# Altium project 12V_SEPIC.PrjPCB
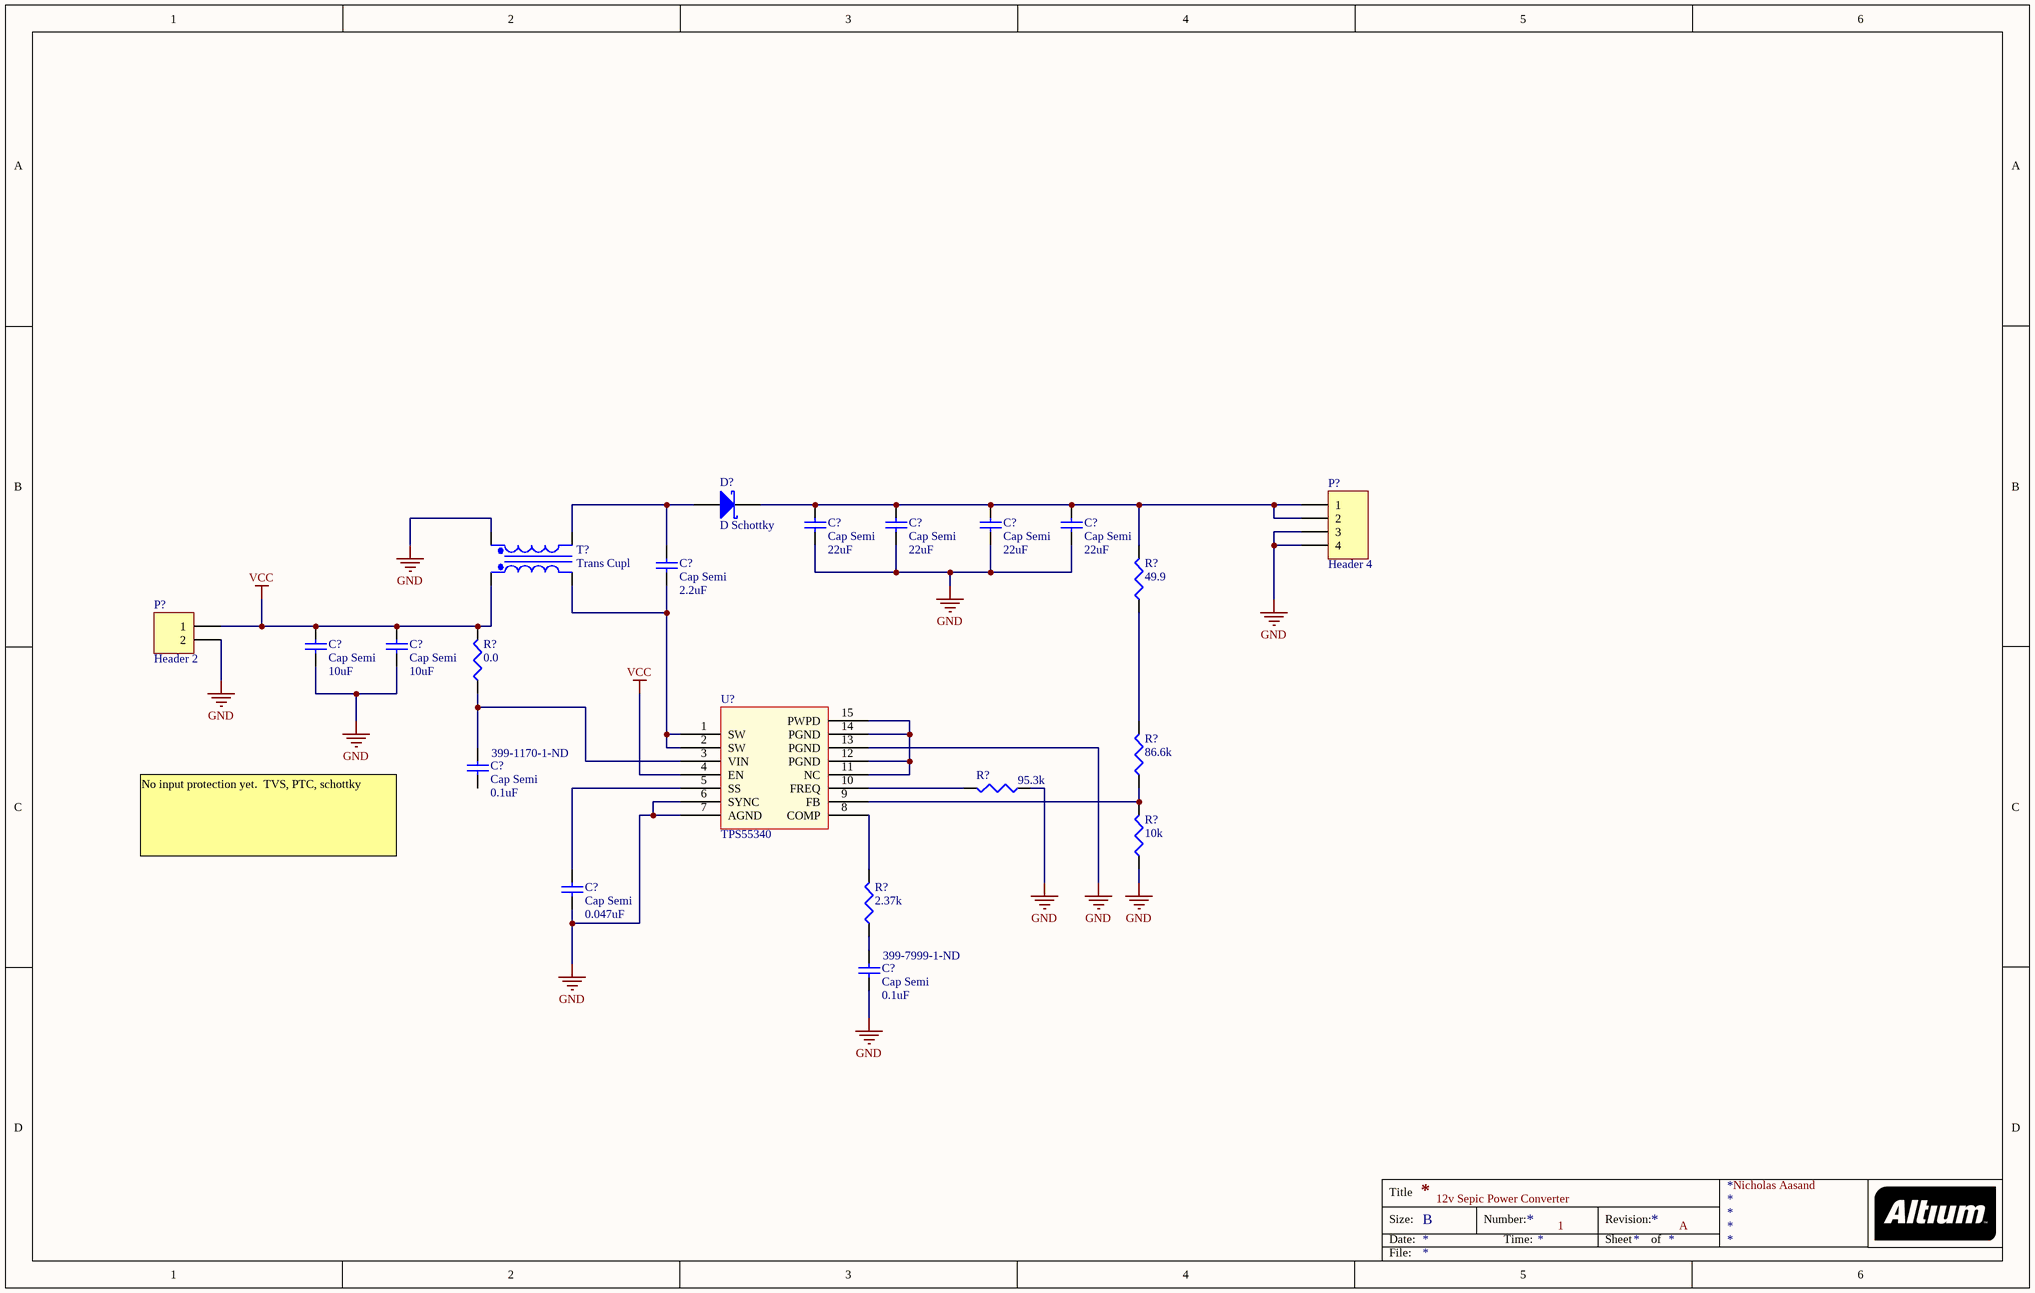
[diagram p0: 12v_SEPIC.SchDoc]
1 sheet, 21 parts. Net scope: global (net labels, ports and power ports of the same name join across sheets).

## Sheet 12v_SEPIC.SchDoc
size B

### Parts
(Parts that share a designator on the sheet are numbered #1, #2 ... from top to bottom, then left to right.)
C?#1  Cap Semi  value 22uF  [C1206]
C?#2  Cap Semi  value 22uF  [C1206]
C?#3  Cap Semi  value 22uF  [C1206]
C?#4  Cap Semi  value 22uF  [C1206]
C?#5  Cap Semi  value 2.2uF  [C1206]
C?#6  Cap Semi  value 10uF  [C1210]
C?#7  Cap Semi  value 10uF  [C1210]
C?#8  Cap Semi  value 0.1uF  Digikey: 399-1170-1-ND  [C0805]
C?#9  Cap Semi  value 0.047uF  [C0805]
C?#10  Cap Semi  value 0.1uF  Digikey: 399-7999-1-ND  [C0805]
D?  D Schottky  [DSO-C2/X1.8]
P?#1  Header 4  [HDR1X4]
P?#2  Header 2  [HDR1X2]
R?#1  value 49.9  [RESC2012L]  (hidden comment: 0805)
R?#2  value 0.0  [J1-0603]  (hidden comment: 0603)
R?#3  value 86.6k  [RESC2012L]  (hidden comment: 0805)
R?#4  value 95.3k  [J1-0603]  (hidden comment: 0603)
R?#5  value 10k  [RESC2012L]  (hidden comment: 0805)
R?#6  value 2.37k  [J1-0603]  (hidden comment: 0603)
T?  Trans Cupl  [TRF_4]
U?  TPS55340

### Nets
GND: C?#1.1 C?#2.1 C?#3.1 C?#4.1 C?#6.2 C?#7.2 C?#9.2 C?#10.2 P?#1.3 P?#1.4 P?#2.2 R?#4.1 R?#5.1 T?.3(Sec+) U?.6(SYNC) U?.7(AGND) U?.13(PGND)
VCC: C?#6.1 C?#7.1 P?#2.1 R?#2.2 T?.1(Pri+) U?.4(EN)
NetC?#1_2: C?#1.2 C?#2.2 C?#3.2 C?#4.2 D?.2(K) P?#1.1 P?#1.2 R?#1.2
NetC?#5_1: C?#5.1 D?.1(A) T?.4(Sec-)
NetC?#5_2: C?#5.2 T?.2(Pri-) U?.1(SW) U?.2(SW)
NetC?#8_1: C?#8.1 R?#2.1 U?.3(VIN)
NetC?#9_1: C?#9.1 U?.5(SS)
NetC?#10_1: C?#10.1 R?#6.1
NetR?#1_1: R?#1.1 R?#3.2
NetR?#3_1: R?#3.1 R?#5.2 U?.9(FB)
NetR?#4_2: R?#4.2 U?.10(FREQ)
NetR?#6_2: R?#6.2 U?.8(COMP)
NetU?_11: U?.11(NC) U?.12(PGND) U?.14(PGND) U?.15(PWPD)

Not connected (* = marked no-connect by the designer): C?#8 2

### Notes on the sheet
- No input protection yet.  TVS, PTC, schottky
- 12v Sepic Power Converter
- 1
- A
- Nicholas Aasand
- Title
- Size:
- Date:
- B
- Number:
- Time:
- Revision:
- Sheet
- of
- File:

### Library data of the parts
C?#1-C?#10 = Cap Semi: Capacitor (Semiconductor SIM Model); Published: 8-Jun-2000; LatestRevisionDate: 29-May-2009; LatestRevisionNote: IPC-7351 Footprint Added.; Publisher: Altium Limited; PackageDescription: Chip Capacitor
  C?#1-C?#4: PackageReference: C1206; Digikey: 1276-3047-1-ND
  C?#5: PackageReference: C1206; Digikey: 1276-1291-1-ND
  C?#6 C?#7: PackageReference: C1206; Digikey: 1276-3389-1-ND
  C?#8 C?#10: PackageReference: C0805
  C?#9: PackageReference: C0805; Digikey: 478-6221-1-ND
D? = D Schottky: Schottky Diode; Published: 8-Jun-2000; LatestRevisionDate: 17-Jul-2002; LatestRevisionNote: Re-released for DXP Platform.; PackageReference: SMA; Publisher: Altium Limited; PackageDescription: DO-214-AA/SMB; 2 C-Bend Leads; Body 5.3 x 3.6 mm, inc. leads (LxW); Code_JEDEC: DO-214-AA; Digikey: 641-1258-1-ND
P?#1 = Header 4: Header, 4-Pin; LatestRevisionDate: 17-Jul-2002; LatestRevisionNote: Re-released for DXP Platform.; Publisher: Altium Limited
P?#2 = Header 2: Header, 2-Pin; LatestRevisionDate: 17-Jul-2002; LatestRevisionNote: Re-released for DXP Platform.; Publisher: Altium Limited
R?#1-R?#6 = Res3: Resistor
  R?#1: Digikey: RMCF0805FT49R9CT-ND
  R?#2: Digikey: RMCF0603ZT0R00CT-ND
  R?#3: Digikey: RMCF0805FT86K6CT-ND
  R?#4: Digikey: RMCF0603FT95K3CT-ND
  R?#5: Digikey: RMCF0805FT10K0CT-ND
  R?#6: Digikey: RMCF0603FT2K37CT-ND
T? = Trans Cupl: Transformer (Coupled Inductor Model); Coilcraft: MSD1260-123MLB; Published: 8-Jun-2000; LatestRevisionDate: 17-Jul-2002; LatestRevisionNote: Re-released for DXP Platform.; PackageReference: TRF_4; Publisher: Altium Limited; PackageDescription: Transformer; 4 Leads
U? = TPS55340: Integrated 5A 40V Boost/SEPIC/Flyback DC-DC Regulator; Digikey: 296-35493-5-ND